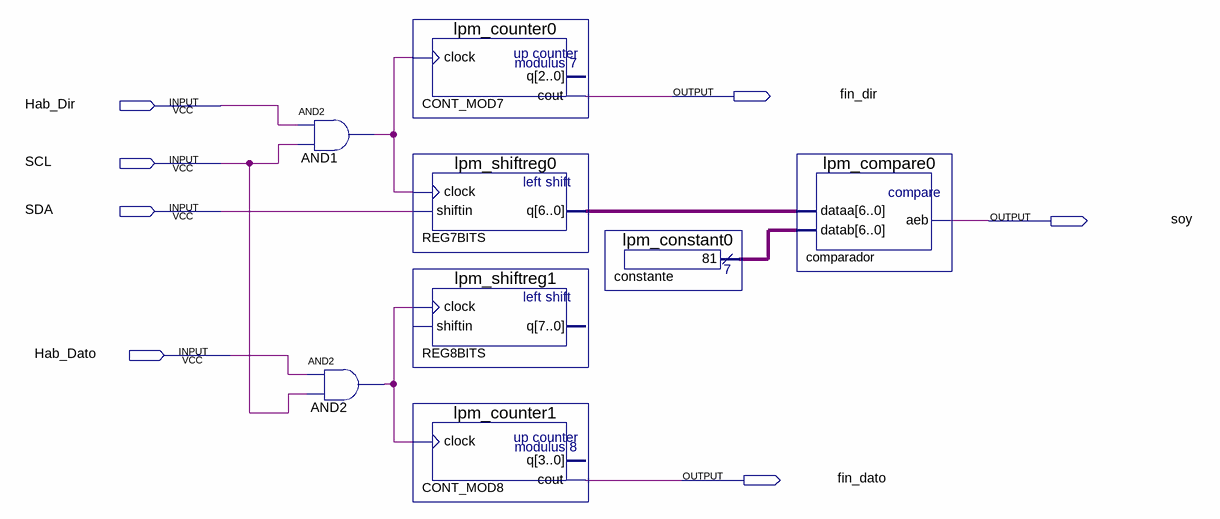
[diagram p0: schematic sheet]
// Quartus schematic I2C_Bloques.bdf as structural Verilog: 8 symbols, 7 pins
module I2C_Bloques (
  input  Hab_Dir,
  input  SCL,
  input  SDA,
  input  Hab_Dato,
  output fin_dir,
  output soy,
  output fin_dato
);

  wire AND1_out, AND2_out;
  wire [6:0] constante_result, REG7BITS_q;

  and AND1 (AND1_out, Hab_Dir, SCL);
  and AND2 (AND2_out, Hab_Dato, SCL);
  lpm_counter0 CONT_MOD7 (.clock(AND1_out), .cout(fin_dir));  // open: q
  lpm_shiftreg0 REG7BITS (.clock(AND1_out), .shiftin(SDA), .q(REG7BITS_q));
  lpm_shiftreg1 REG8BITS (.clock(AND2_out));  // open: shiftin, q
  lpm_counter1 CONT_MOD8 (.clock(AND2_out), .cout(fin_dato));  // open: q
  lpm_constant0 constante (.result(constante_result));
  lpm_compare0 comparador (.dataa(REG7BITS_q), .datab(constante_result), .aeb(soy));
endmodule
